# EasyEDA Pro project MyLightThingy.epro

# Schematic Schematic1
Board Name: Board1; Create Date: 2026-03-28; Page Name: P1; Project Name: MyLightThingy; Schematic Name: Schematic1; Update Date: 2026-03-28; Company: EasyEDA.com; Page Size: A4; Version: V1.0
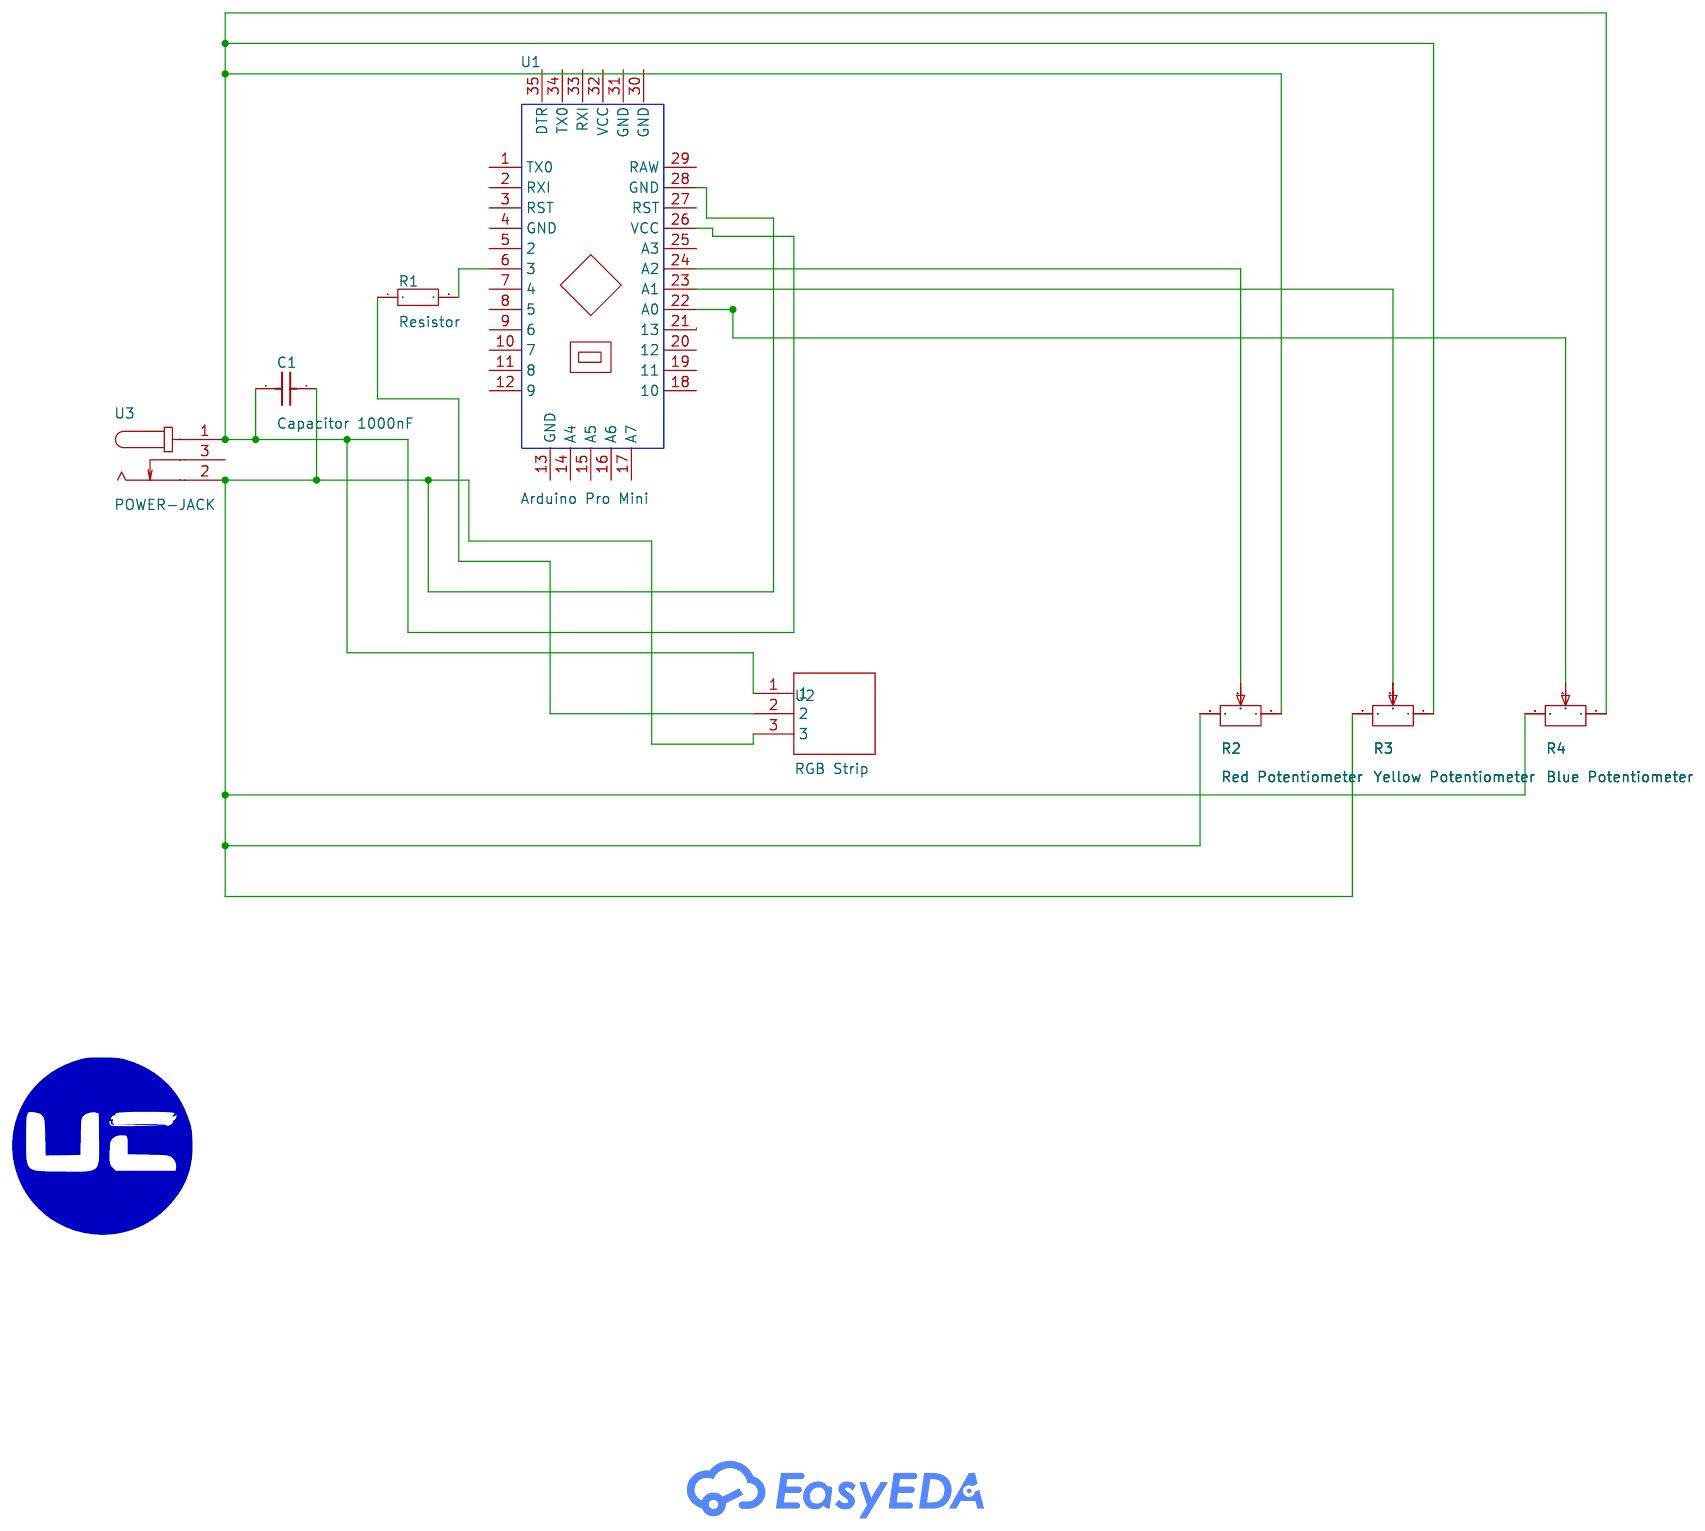
[diagram p0: schematic sheet]

## Parts
C1  Capacitor 1000nF  [CAP-TH_L7.2-W2.5-P5.00-D0.5_224CL0016]
R1  Resistor  [Resistor 1/8w 7mm metal film]
R2  10kΩ  [RES-ADJ-TH_RK1631110TT3]
R3  10kΩ  [RES-ADJ-TH_RK1631110TT3]
R4  10kΩ  [RES-ADJ-TH_RK1631110TT3]
U1  Arduino Pro Mini  [Arduino_Pro_Mini]
U2  RGB Strip  [V3 pin male 3x1]
U3  POWER-JACK  [DC-IN-TH_POWER-JACK]

## Library data of the parts
C1 = Avg Film cap: 1pf - 100nf box film cap; Supplier: LCSC; Manufacturer Part: CL21B104KCFNNNE; Manufacturer: SAMSUNG(三星); Supplier Part: C28233; JLCPCB Part Class: Basic Part
R1 = resistor: Supplier: LCSC; Manufacturer: UNI-ROYAL(Uniroyal Elec); Manufacturer Part: 1206W4F1002T5E; Supplier Part: C17902; Resistance: 10KΩ; JLCPCB Part Class: Basic Part; Datasheet: https://datasheet.lcsc.com/lcsc/2206010145_UNI-ROYAL-Uniroyal-Elec-1206W4F1002T5E_C17902.pdf
R2-R4 = Potentiometer: Resistance: Tolerance:±20% Tolerance:±20% Power(Watts):50mW Turns:- Rated Voltage:5V; LCSC Part Name: 10kΩ ±20% 3件套; Supplier Part: C370977; Manufacturer: ALPSALPINE(阿尔卑斯阿尔派); Manufacturer Part: RK1631110TT3; Supplier Footprint: 插件; JLCPCB Part Class: Extended Part; Datasheet: https://atta.szlcsc.com/upload/public/pdf/source/20191216/C470593_7E935C2EB9A734DEAF0A292D32EDD773.pdf; Supplier: LCSC; Tolerance: ±20%; Power(Watts): 50mW; Rated Voltage: 5V
U1 = Arduino Pro Mini
U2 = V3 pin male 3x1: Supplier Part: https://nl.mouser.com/ProductDetail/571-872243; BomId: pm5; Supplier: Mouser; Manufacturer: TE Connectivity
U3 = POWER-JACK: Supplier Part: C9900001795; JLCPCB Part Class: Extended Part; Supplier: LCSC

## Nets
$1N637: C1.1 R2.1 R3.1 R4.1 U1.26(VCC) U2.1 U3.1
$1N773: R3.2 U1.23(A1)
$1N1367: R1.1 U2.2
$1N1371: R1.2 U1.6(3)
$1N1633: C1.2 R2.3 R3.3 R4.3 U1.28(GND) U2.3 U3.2
$1N1642: R2.2 U1.24(A2)
$1N1851: R4.2 U1.22(A0)

Not connected (* = marked no-connect by the designer): U1 1(TX0) 2(RXI) 3(RST) 4(GND) 5(2) 7(4) 8(5) 9(6) 10(7) 11(8) 12(9) 13(GND) 14(A4) 15(A5) 16(A6) 17(A7) 18(10) 19(11) 20(12) 21(13) 25(A3) 27(RST) 29(RAW) 30(GND) 31(GND) 32(VCC) 33(RXI) 34(TX0) 35(DTR); U3 3

# Board PCB1
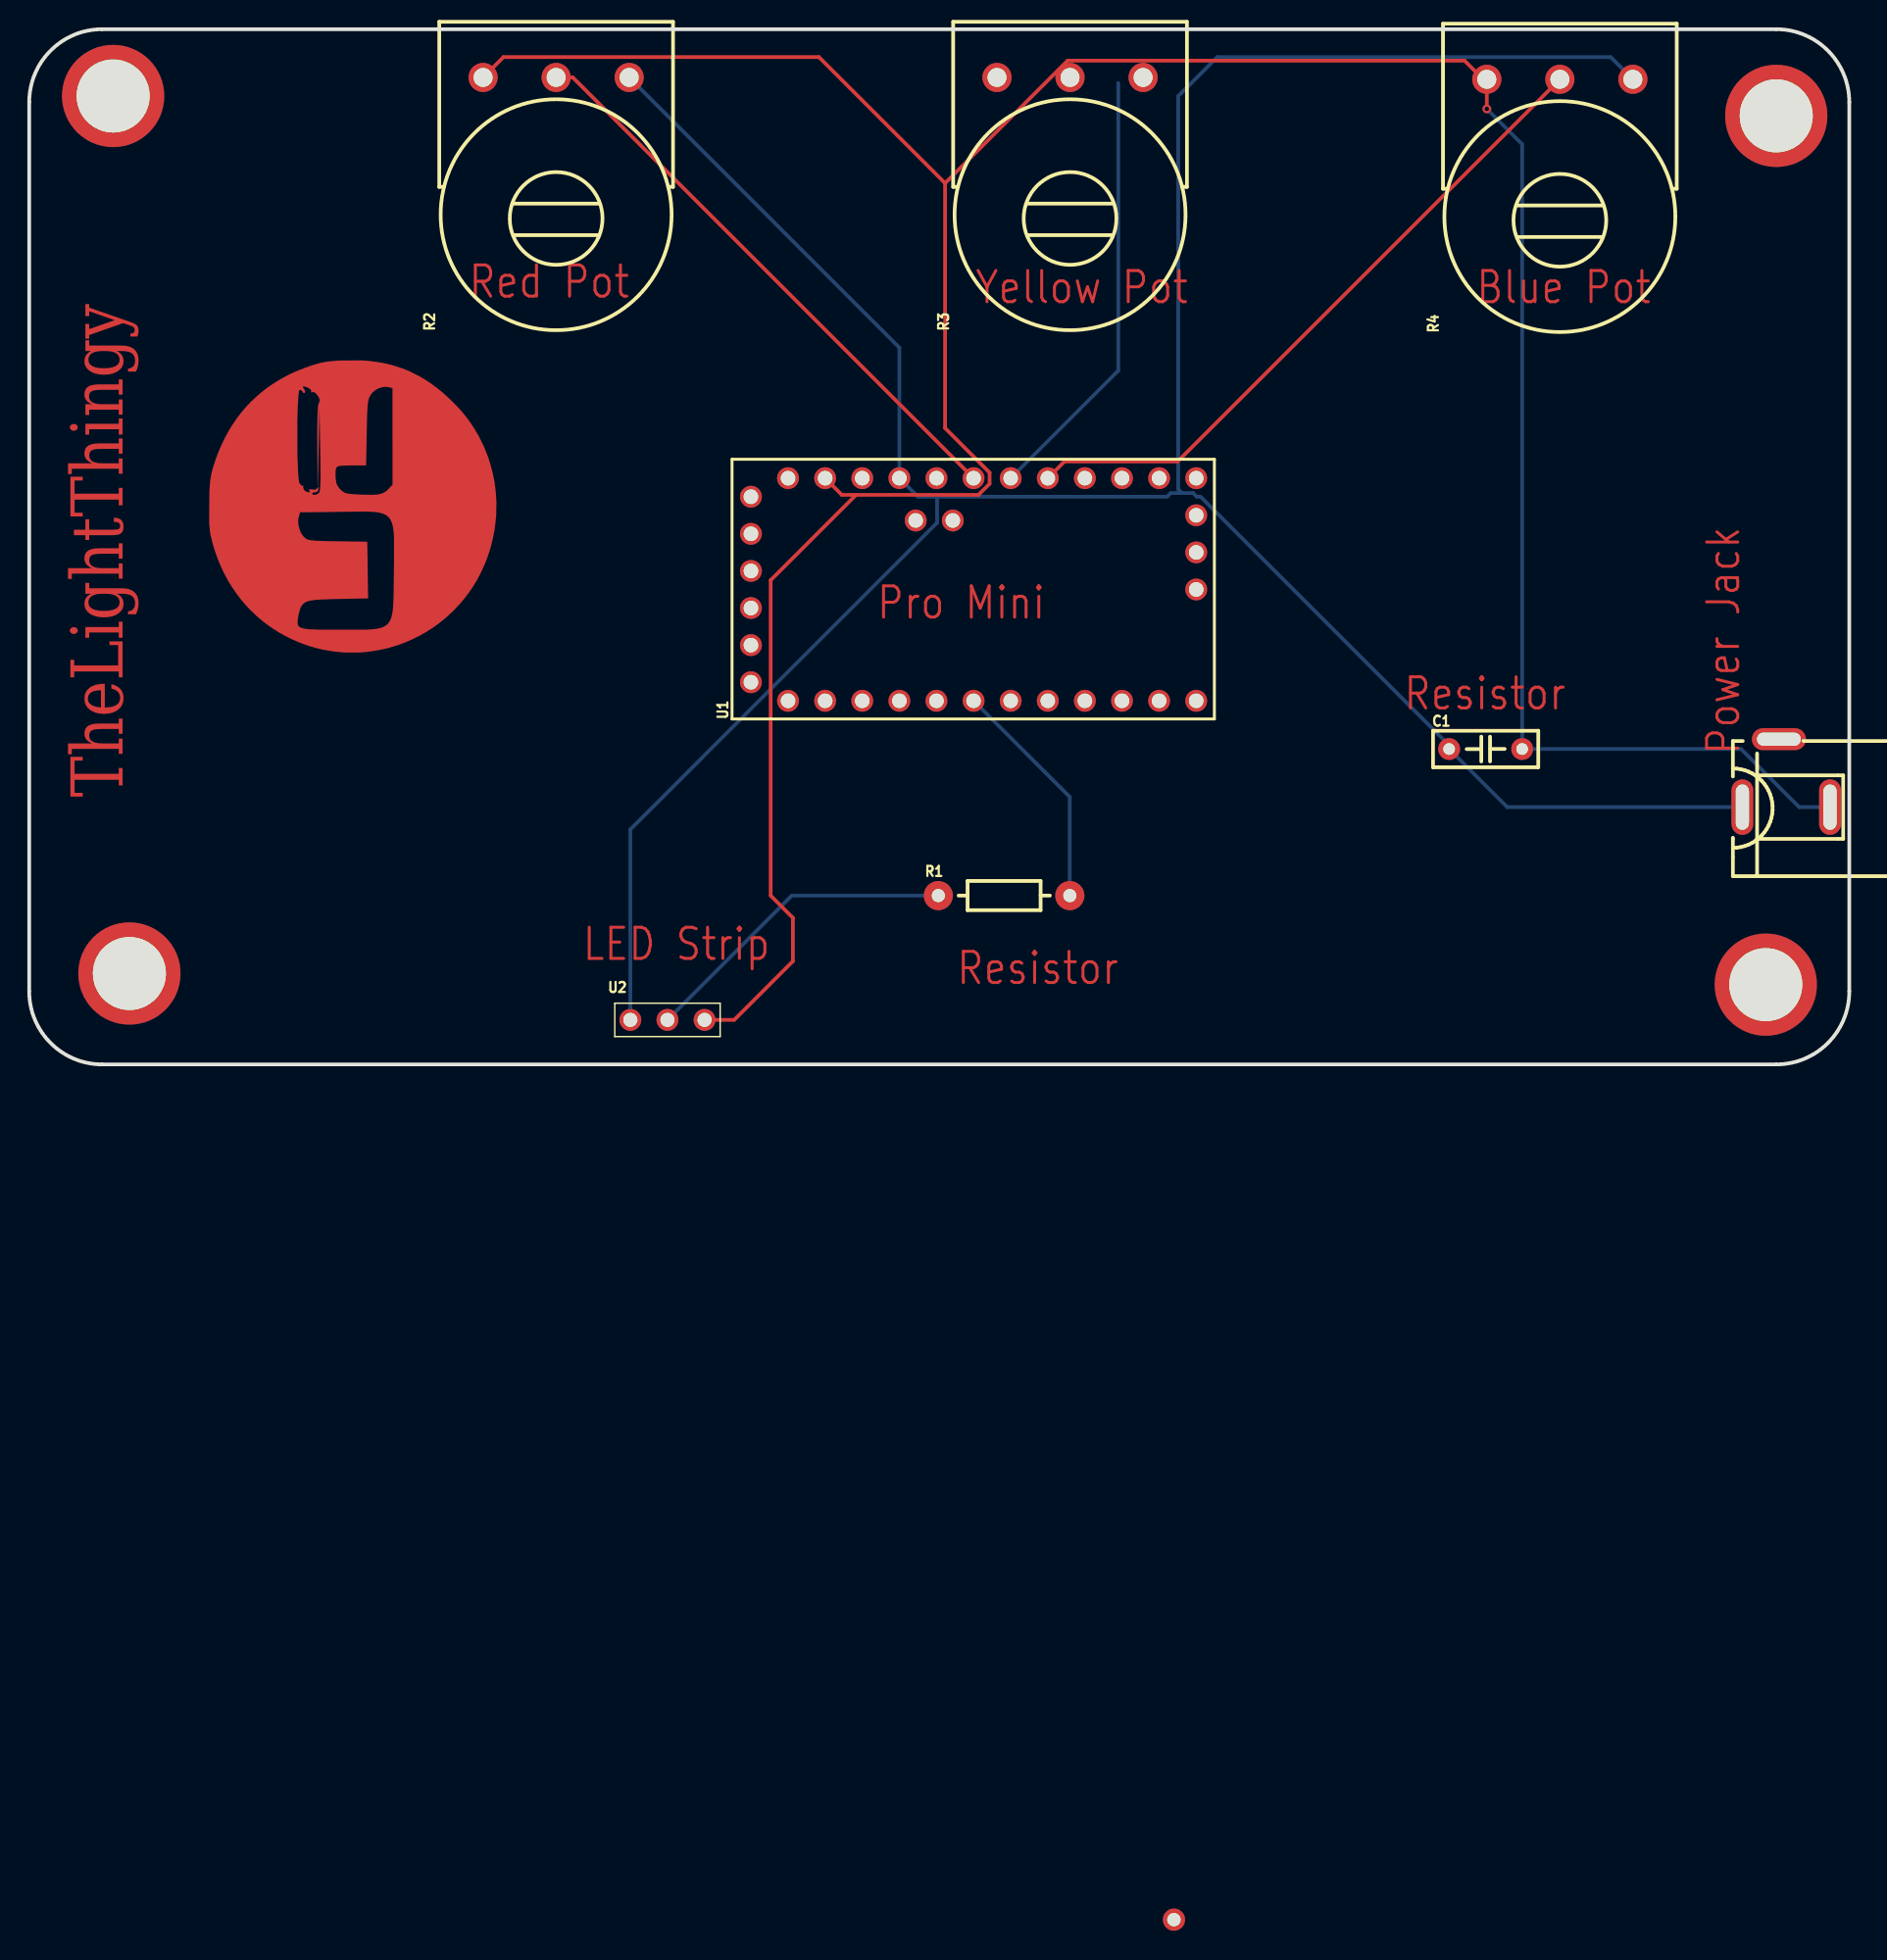
[diagram p1: board, top side]
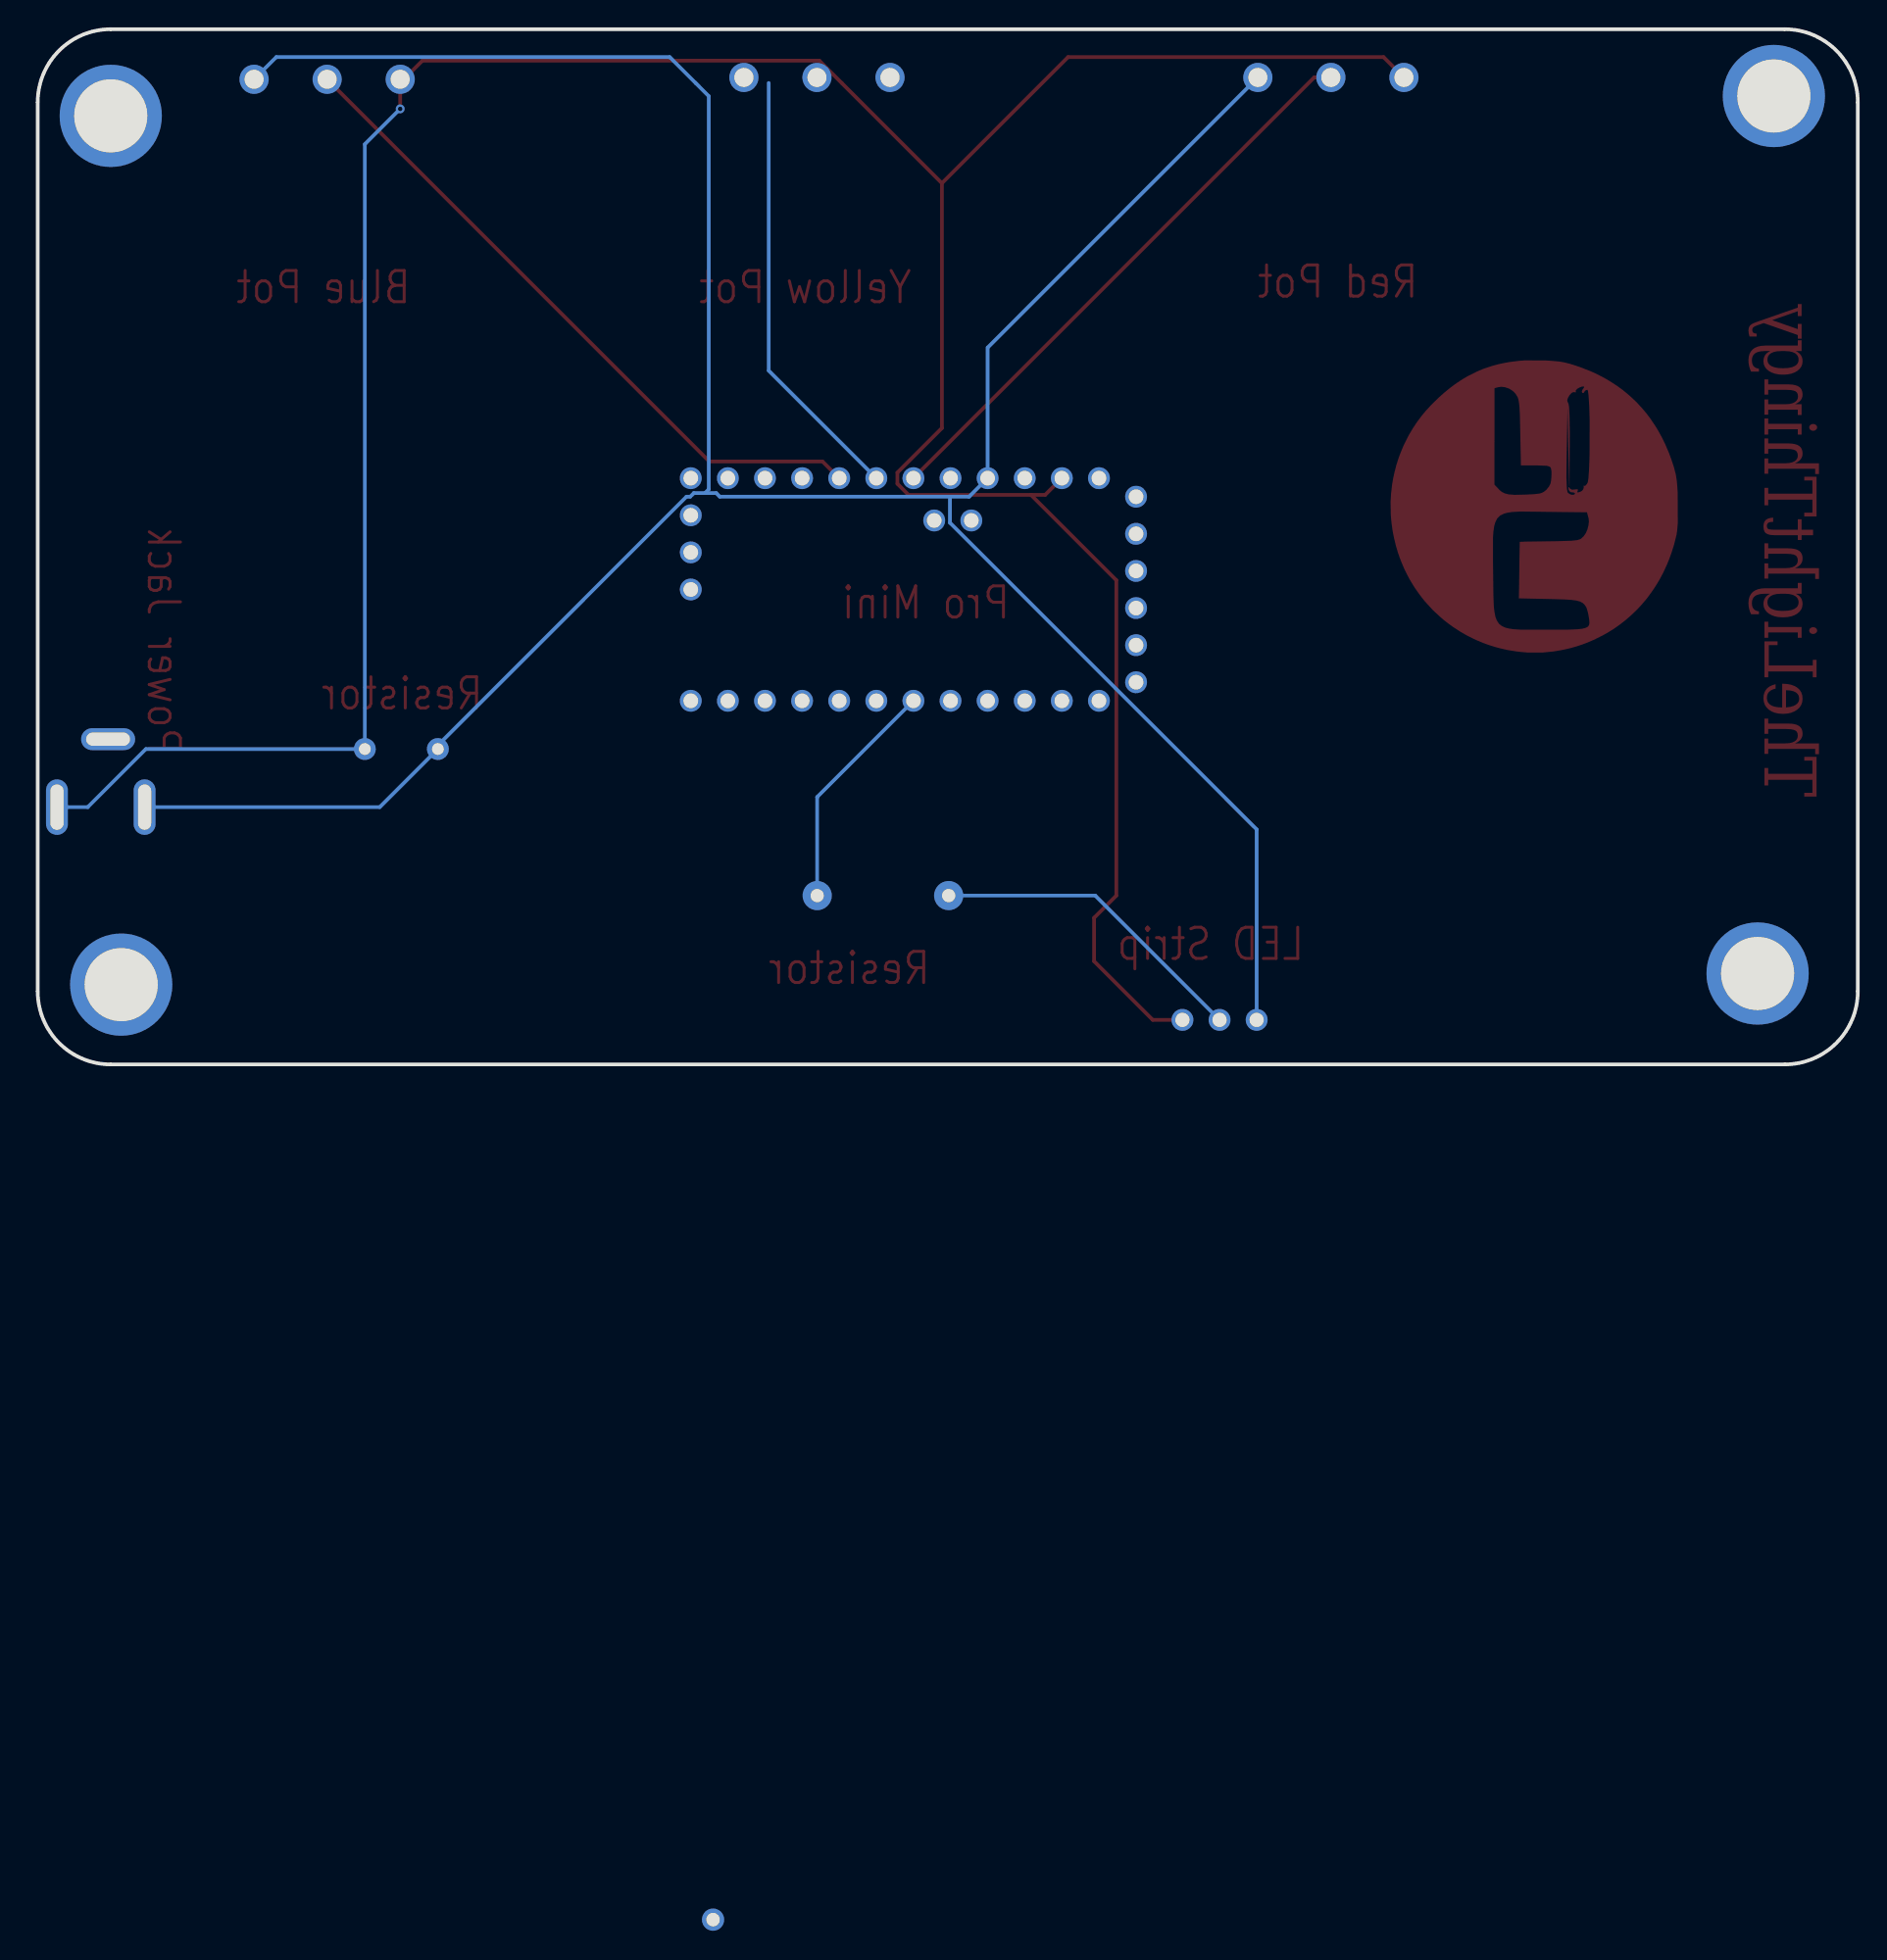
[diagram p2: board, bottom side, seen from below]

Outline 124.59 x 70.87 mm; copper layers: Top Layer, Bottom Layer. Coordinates in mm from the lower left corner of the outline.
Outline path: 0,65.87 0,5 arc(1.46,1.46) 5,0 119.59,0 arc(123.12,1.46) 124.59,5 124.59,65.87 arc(123.12,69.4) 119.59,70.87 5,70.87 arc(1.46,69.4) 0,65.87
Stack: Top Layer 0.035mm / Dielectric1 1.51mm FR4 er 4.5 / Bottom Layer 0.035mm

## Design rules (mm)
template: JLCPCB Capability(Two Layers Board)
spacing copperThickness1oz (default): track to track 0.102, other pairs 0.152 to 0.3
spacing copperThickness2oz: track to track 0.203, other pairs 0.152 to 0.3
track width copperThickness1oz (default): min 0.127, default 0.254, max 2.54
track width copperThickness2oz: min 0.203, default 0.254, max 2.54
differential pair differentialPair (default): width min 0.127, default 0.254, max 2.54; gap min 0.152, default 0.152
via viaSize (default): diameter min 0.5, default 0.61, max 10; hole min 0.3, default 0.305, max 6.3

## Placement (name value [footprint] x y rotation side)
C1  Capacitor 1000nF  [CAP-TH_L7.2-W2.5-P5.00-D0.5_224CL0016]  99.7 21.59 0 top
NOREF  -  [Pad_e705]  5.74 66.29 0 top
NOREF#2  -  [Pad_e29]  78.36 -58.55 0 top
NOREF#3  -  [Pad_e709]  119.59 64.93 0 top
NOREF#4  -  [Pad_e708]  118.87 5.46 0 top
NOREF#5  -  [Pad_e707]  6.86 6.22 0 top
R1  Resistor  [Resistor 1/8w 7mm metal film]  62.23 11.56 0 top
R2  10kΩ  [RES-ADJ-TH_RK1631110TT3]  36.07 67.56 90 top
R3  10kΩ  [RES-ADJ-TH_RK1631110TT3]  71.25 67.56 90 top
R4  10kΩ  [RES-ADJ-TH_RK1631110TT3]  104.77 67.44 90 top
U1  Arduino Pro Mini  [Arduino_Pro_Mini]  63.37 32.51 90 top
U2  RGB Strip  [V3 pin male 3x1]  41.15 3.05 0 top
U3  POWER-JACK  [DC-IN-TH_POWER-JACK]  120.27 19.94 180 top

## Footprints (pads in the part's own frame, mm; a bottom-side part is the same pattern mirrored in y, then rotated)
Arduino_Pro_Mini
  round 1.5 hole 1: 1(-7.62,11.43) 2(-7.62,8.89) 3(-7.62,6.35) 4(-7.62,3.81) 5(-7.62,1.27) 6(-7.62,-1.27) 7(-7.62,-3.81) 8(-7.62,-6.35) 9(-7.62,-8.89) 10(-7.62,-11.43) 11(-7.62,-13.97) 12(-7.62,-16.51) 13(0,-16.51) 14(4.724,0.152) 15(4.724,2.692) 16(2.54,-16.51) 17(5.08,-16.51) 18(7.62,-16.51) 19(7.62,-13.97) 20(7.62,-11.43) 21(7.62,-8.89) 22(7.62,-6.35) 23(7.62,-3.81) 24(7.62,-1.27) 25(7.62,1.27) 26(7.62,3.81) 27(7.62,6.35) 28(7.62,8.89) 29(7.62,11.43) 30(6.35,13.97) 31(3.81,13.97) 32(1.27,13.97) 33(-1.27,13.97) 34(-3.81,13.97) 35(-6.35,13.97)
CAP-TH_L7.2-W2.5-P5.00-D0.5_224CL0016
  round 1.5 hole 0.8: 1(-2.5,0) 2(2.5,0)
DC-IN-TH_POWER-JACK
  oval 1.5x3.8 hole 0.9x3.1: 1(2.999,2.325) 2(-2.999,2.325)
  oval 3.7x1.5 hole 3x0.9: 3(0.5,-2.325)
Pad_e29
  round 1.524 hole 0.914: 6(0,0)
Pad_e705
  round 7 hole 5: 2(0,0)
Pad_e707
  round 7 hole 5: 2(0,0)
Pad_e708
  round 7 hole 5: 2(0,0)
Pad_e709
  round 7 hole 5: 2(0,0)
RES-ADJ-TH_RK1631110TT3
  round 2 hole 1.3: 1(0,-5) 2(0,0) 3(0,5)
Resistor 1/8w 7mm metal film
  round 2 hole 0.9: 1(0,0) 2(9,0)
V3 pin male 3x1
  round 1.501 hole 0.965: 1(0,0) 2(2.54,0) 3(5.08,0)

## Nets
As in the schematic.

Pads without a net: NOREF 2; NOREF#2 6; NOREF#3 2; NOREF#4 2; NOREF#5 2; U1 1 2 3 4 5 7 8 9 10 11 12 13 14 15 16 17 18 19 20 25 27 29 30 31 32 33 34 35; U3 3

## Via types
v1: diameter 0.61, hole 0.305, Top Layer to Bottom Layer, 1 via

## Routing (per net, layer and track width the routed paths; a pad name or vN(x,y) marks a point on that pad's centre or on a via; arc(x,y) is an arc through that point)
$1N637: length 207.1
  Bottom Layer w0.254: U2.1 41.15,16.09 62.14,37.08 62.14,38.86 ; 62.14,38.86 77.89,38.86 78.14,39.12 78.91,39.12 ; 62.14,38.86 60.83,38.86 U1.26 59.56,49.07 R2.1 ; 78.91,39.12 78.65,39.37 78.65,66.29 81.33,68.96 108.25,68.96 R4.1 ; 78.91,39.12 79.67,39.12 79.92,38.86 80.18,38.86 97.2,21.84 C1.1 101.17,17.61 U3.1
$1N773: length 30.1
  Bottom Layer w0.254: U1.23 74.55,47.5 74.55,67.18
$1N1367: length 22.1
  Bottom Layer w0.254: R1.1 52.2,11.56 U2.2
$1N1371: length 16.1
  Bottom Layer w0.254: U1.6 71.23,18.3 R1.2
$1N1633: length 223.1
  Top Layer w0.254: 62.69,60.32 54.05,68.96 32.47,68.96 R2.3 ; 62.69,60.32 62.69,43.56 65.74,40.51 65.74,39.75 64.98,38.99 56.6,38.99 ; 62.69,60.32 71.08,68.71 98.25,68.71 99.77,67.19 ; 56.6,38.99 50.75,33.15 50.75,11.56 52.28,10.03 52.28,7.06 48.26,3.05 U2.3 ; 56.6,38.99 55.63,38.99 U1.28 ; 99.77,67.19 R4.3 ; 99.77,67.19 v1(99.77,65.41)
  Bottom Layer w0.254: v1(99.77,65.41) 102.2,62.99 C1.2 117.18,21.59 121.16,17.61 U3.2
$1N1642: length 39.9
  Top Layer w0.254: U1.24 37.21,67.56 R2.2
$1N1851: length 46.4
  Top Layer w0.254: U1.22 70.87,41.27 78.61,41.27 R4.2

Small or netless copper shapes (teardrops, artwork), in the pictures only: 1 on Top Layer

## Text on the board
Top Layer: Red Pot | LED Strip | Pro Mini | Resistor | Yellow Pot | Blue Pot | Power Jack | TheLightThingy
